# Altium schematic sheet RotSense.SchDoc
size Letter; CompanyName: Ploopy Corporation; Organization: Ploopy Corporation; Address1: Suite 226, 137-1140 Burnhamthorpe Road W; Address2: Mississauga; Address3: Ontario; Address4: Canada L5C 0A3; DocumentNumber: 7; Revision: R1.001; SheetNumber: 7; SheetTotal: 7
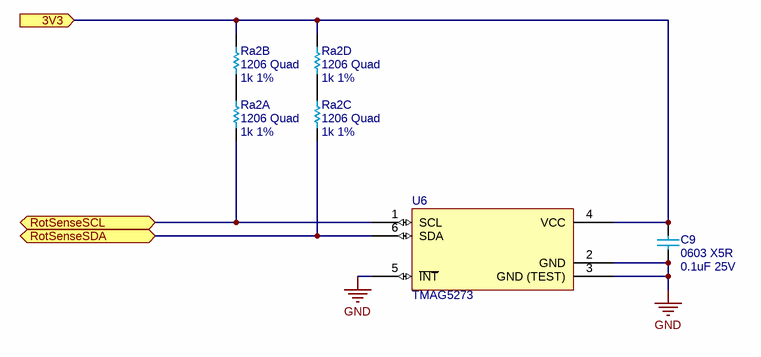
[diagram p0: RotSense.SchDoc]

## Parts
C9  0603 X5R  value 0.1uF 25V  [0603 capacitor - CAPC1608X06N]
Ra2  1206 Quad  value 1k 1%  [4x 1k 1% - CAC-80P320X160-8M]  (parts A,B,C,D of 4)
U6  TMAG5273  [TMAG5273 - SOT95P280X145-6M]

## Ports
3V3 (in), RotSenseSCL (bidir), RotSenseSDA (bidir)

## Nets
GND: C9.1 U6.2(GND) U6.3(GND_(TEST)) U6.5(~{INT})
3V3: C9.2 Ra2.5 Ra2.7 U6.4(VCC) ; port 3V3
RotSenseSCL: Ra2.1 U6.1(SCL) ; port RotSenseSCL
RotSenseSDA: Ra2.3 U6.6(SDA) ; port RotSenseSDA
NetRa2_2: Ra2.2 Ra2.8
NetRa2_4: Ra2.4 Ra2.6

## Notes on the sheet
- Copyright Ploopy Corporation
- Licensed under the CERN-OHL-S v2
- http://ohwr.org/cernohl
- Title:
- PCB:
- Version:
- Ploopy Corporation
- Mississauga ON L5C 0A3
- 137-1140 Burnhamthorpe Road W
- Date:
- Time:
- Sheet
- of
- Canada

## Library data of the parts
C9 = Cap 0.1uF 25V: 0603, X5R or better; Supplier 1: Digi-Key; Supplier Part Number 1: 1276-6840-2-ND
Ra2 = Quad Res 1k 1% 1206: Chip resistor
U6 = TMAG5273: Low-Power Linear 3D Hall-Effect Sensor With I2C Interface